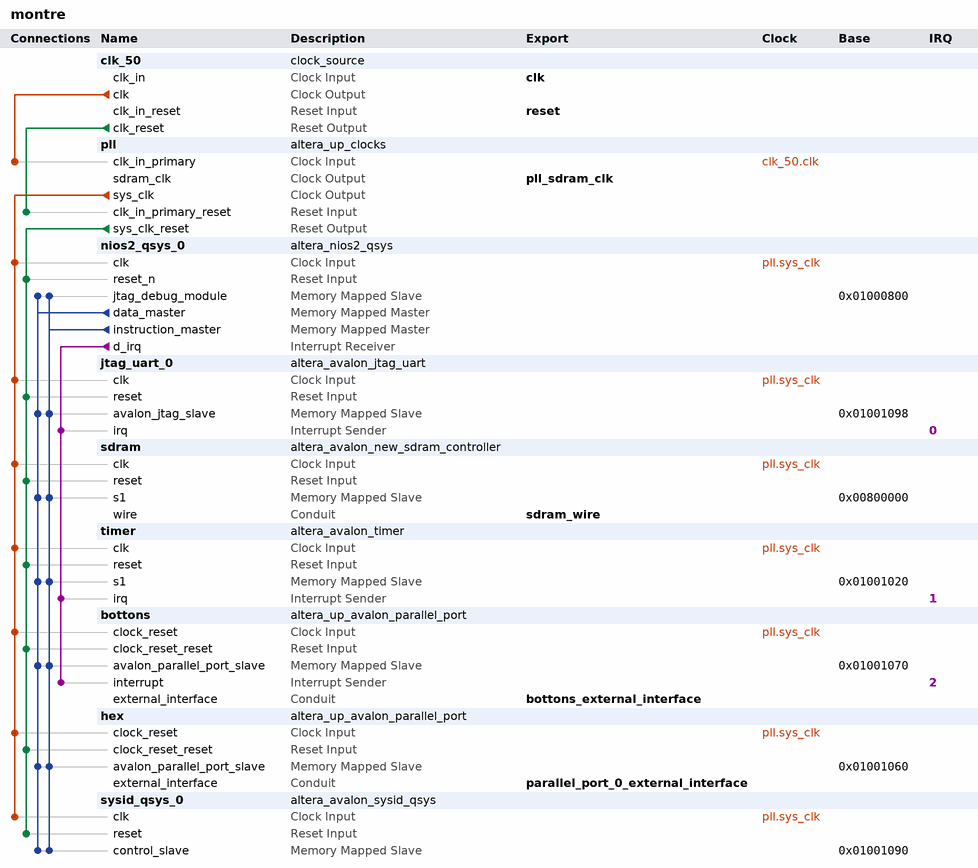
[diagram p0: system contents]
# Platform Designer (Qsys) system montre, Cyclone II EP2C20F484C7
# Parameters at their usual value, and those the tool derives, are not listed.
package require -exact qsys 13.0
create_system montre
set_project_property DEVICE_FAMILY {Cyclone II}
set_project_property DEVICE EP2C20F484C7

add_instance clk_50 clock_source 13.0
set_instance_parameter_value clk_50 clockFrequency 50000000

add_instance pll altera_up_clocks 13.0
set_instance_parameter_value pll board DE1
set_instance_parameter_value pll vga_clk false
set_instance_parameter_value pll audio_clk false
set_instance_parameter_value pll audio_clk_freq 12.288

add_instance nios2_qsys_0 altera_nios2_qsys 13.0
set_instance_parameter_value nios2_qsys_0 resetSlave sdram.s1
set_instance_parameter_value nios2_qsys_0 mmu_TLBMissExcSlave None
set_instance_parameter_value nios2_qsys_0 exceptionSlave sdram.s1
set_instance_parameter_value nios2_qsys_0 breakSlave nios2_qsys_0.jtag_debug_module
set_instance_parameter_value nios2_qsys_0 impl Tiny
set_instance_parameter_value nios2_qsys_0 icache_size 4096

add_instance jtag_uart_0 altera_avalon_jtag_uart 13.0.1.99.2
set_instance_parameter_value jtag_uart_0 simInteractiveOptions NO_INTERACTIVE_WINDOWS

add_instance sdram altera_avalon_new_sdram_controller 13.0.1.99.2
set_instance_parameter_value sdram TAC 5.5
set_instance_parameter_value sdram TRCD 20.0
set_instance_parameter_value sdram TRP 20.0
set_instance_parameter_value sdram casLatency 3
set_instance_parameter_value sdram columnWidth 8
set_instance_parameter_value sdram dataWidth 16
set_instance_parameter_value sdram generateSimulationModel false
set_instance_parameter_value sdram model single_Micron_MT48LC4M32B2_7_chip
set_instance_parameter_value sdram numberOfBanks 4
set_instance_parameter_value sdram numberOfChipSelects 1
set_instance_parameter_value sdram powerUpDelay 100.0
set_instance_parameter_value sdram refreshPeriod 15.625
set_instance_parameter_value sdram rowWidth 12

add_instance timer altera_avalon_timer 13.0.1.99.2
set_instance_parameter_value timer period 1
set_instance_parameter_value timer periodUnits SEC

add_instance bottons altera_up_avalon_parallel_port 13.0
set_instance_parameter_value bottons board DE1
set_instance_parameter_value bottons preset Pushbuttons
set_instance_parameter_value bottons capture true
set_instance_parameter_value bottons edge Rising
set_instance_parameter_value bottons irq true

add_instance hex altera_up_avalon_parallel_port 13.0
set_instance_parameter_value hex board DE1
set_instance_parameter_value hex preset {Seven Segment Displays}
set_instance_parameter_value hex capture false
set_instance_parameter_value hex edge Rising
set_instance_parameter_value hex irq false

add_instance sysid_qsys_0 altera_avalon_sysid_qsys 13.0
set_instance_parameter_value sysid_qsys_0 id 0

# connections
add_connection clk_50.clk pll.clk_in_primary clock
add_connection pll.sys_clk bottons.clock_reset clock
add_connection pll.sys_clk hex.clock_reset clock
add_connection pll.sys_clk jtag_uart_0.clk clock
add_connection pll.sys_clk nios2_qsys_0.clk clock
add_connection pll.sys_clk sdram.clk clock
add_connection pll.sys_clk sysid_qsys_0.clk clock
add_connection pll.sys_clk timer.clk clock
add_connection clk_50.clk_reset pll.clk_in_primary_reset reset
add_connection pll.sys_clk_reset bottons.clock_reset_reset reset
add_connection pll.sys_clk_reset hex.clock_reset_reset reset
add_connection pll.sys_clk_reset jtag_uart_0.reset reset
add_connection pll.sys_clk_reset nios2_qsys_0.reset_n reset
add_connection pll.sys_clk_reset sdram.reset reset
add_connection pll.sys_clk_reset sysid_qsys_0.reset reset
add_connection pll.sys_clk_reset timer.reset reset
add_connection nios2_qsys_0.data_master bottons.avalon_parallel_port_slave avalon
set_connection_parameter_value nios2_qsys_0.data_master/bottons.avalon_parallel_port_slave baseAddress 0x01001070
add_connection nios2_qsys_0.data_master hex.avalon_parallel_port_slave avalon
set_connection_parameter_value nios2_qsys_0.data_master/hex.avalon_parallel_port_slave baseAddress 0x01001060
add_connection nios2_qsys_0.data_master jtag_uart_0.avalon_jtag_slave avalon
set_connection_parameter_value nios2_qsys_0.data_master/jtag_uart_0.avalon_jtag_slave baseAddress 0x01001098
add_connection nios2_qsys_0.data_master nios2_qsys_0.jtag_debug_module avalon
set_connection_parameter_value nios2_qsys_0.data_master/nios2_qsys_0.jtag_debug_module baseAddress 0x01000800
add_connection nios2_qsys_0.data_master sdram.s1 avalon
set_connection_parameter_value nios2_qsys_0.data_master/sdram.s1 baseAddress 0x00800000
add_connection nios2_qsys_0.data_master sysid_qsys_0.control_slave avalon
set_connection_parameter_value nios2_qsys_0.data_master/sysid_qsys_0.control_slave baseAddress 0x01001090
add_connection nios2_qsys_0.data_master timer.s1 avalon
set_connection_parameter_value nios2_qsys_0.data_master/timer.s1 baseAddress 0x01001020
add_connection nios2_qsys_0.instruction_master bottons.avalon_parallel_port_slave avalon
set_connection_parameter_value nios2_qsys_0.instruction_master/bottons.avalon_parallel_port_slave baseAddress 0x01001070
add_connection nios2_qsys_0.instruction_master hex.avalon_parallel_port_slave avalon
set_connection_parameter_value nios2_qsys_0.instruction_master/hex.avalon_parallel_port_slave baseAddress 0x01001060
add_connection nios2_qsys_0.instruction_master jtag_uart_0.avalon_jtag_slave avalon
set_connection_parameter_value nios2_qsys_0.instruction_master/jtag_uart_0.avalon_jtag_slave baseAddress 0x01001098
add_connection nios2_qsys_0.instruction_master nios2_qsys_0.jtag_debug_module avalon
set_connection_parameter_value nios2_qsys_0.instruction_master/nios2_qsys_0.jtag_debug_module baseAddress 0x01000800
add_connection nios2_qsys_0.instruction_master sdram.s1 avalon
set_connection_parameter_value nios2_qsys_0.instruction_master/sdram.s1 baseAddress 0x00800000
add_connection nios2_qsys_0.instruction_master sysid_qsys_0.control_slave avalon
set_connection_parameter_value nios2_qsys_0.instruction_master/sysid_qsys_0.control_slave baseAddress 0x01001090
add_connection nios2_qsys_0.instruction_master timer.s1 avalon
set_connection_parameter_value nios2_qsys_0.instruction_master/timer.s1 baseAddress 0x01001020
add_connection nios2_qsys_0.d_irq bottons.interrupt interrupt
set_connection_parameter_value nios2_qsys_0.d_irq/bottons.interrupt irqNumber 2
add_connection nios2_qsys_0.d_irq jtag_uart_0.irq interrupt
set_connection_parameter_value nios2_qsys_0.d_irq/jtag_uart_0.irq irqNumber 0
add_connection nios2_qsys_0.d_irq timer.irq interrupt
set_connection_parameter_value nios2_qsys_0.d_irq/timer.irq irqNumber 1

# exported interfaces
add_interface sdram_wire conduit end
set_interface_property sdram_wire EXPORT_OF sdram.wire
add_interface bottons_external_interface conduit end
set_interface_property bottons_external_interface EXPORT_OF bottons.external_interface
add_interface parallel_port_0_external_interface conduit end
set_interface_property parallel_port_0_external_interface EXPORT_OF hex.external_interface
add_interface clk clock sink
set_interface_property clk EXPORT_OF clk_50.clk_in
add_interface pll_sdram_clk clock source
set_interface_property pll_sdram_clk EXPORT_OF pll.sdram_clk
add_interface reset reset sink
set_interface_property reset EXPORT_OF clk_50.clk_in_reset

set_interconnect_requirement {$system} qsys_mm.clockCrossingAdapter HANDSHAKE
set_interconnect_requirement {$system} qsys_mm.maxAdditionalLatency 1

save_system montre.qsys
